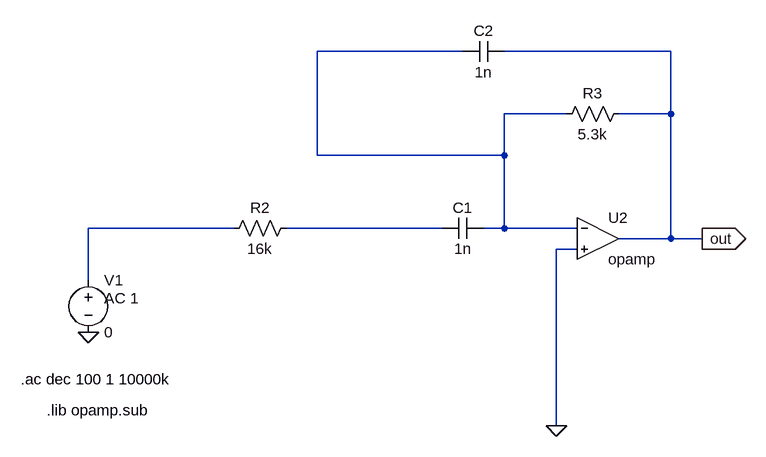
[diagram p0: schematic band_pass_ActFilter1.asc]
band_pass_ActFilter1.asc, the LTspice schematic file:
Version 4
SHEET 1 1200 680
WIRE 352 -512 128 -512
WIRE 672 -512 416 -512
WIRE 512 -416 416 -416
WIRE 672 -416 672 -512
WIRE 672 -416 592 -416
WIRE 128 -352 128 -512
WIRE 416 -352 416 -416
WIRE 416 -352 128 -352
WIRE 0 -240 -224 -240
WIRE 320 -240 80 -240
WIRE 416 -240 416 -352
WIRE 416 -240 384 -240
WIRE 528 -240 416 -240
WIRE 672 -224 672 -416
WIRE 672 -224 592 -224
WIRE 720 -224 672 -224
WIRE 528 -208 496 -208
WIRE -224 -160 -224 -240
WIRE 496 64 496 -208
FLAG 496 64 0
FLAG -224 -80 0
FLAG 720 -224 out
IOPIN 720 -224 Out
SYMBOL res 96 -256 R90
WINDOW 0 0 56 VBottom 2
WINDOW 3 32 56 VTop 2
SYMATTR InstName R2
SYMATTR Value 16k
SYMBOL res 608 -432 R90
WINDOW 0 0 56 VBottom 2
WINDOW 3 32 56 VTop 2
SYMATTR InstName R3
SYMATTR Value 5.3k
SYMBOL cap 384 -256 R90
WINDOW 0 0 32 VBottom 2
WINDOW 3 32 32 VTop 2
SYMATTR InstName C1
SYMATTR Value 1n
SYMBOL cap 416 -528 R90
WINDOW 0 0 32 VBottom 2
WINDOW 3 32 32 VTop 2
SYMATTR InstName C2
SYMATTR Value 1n
SYMBOL voltage -224 -176 R0
WINDOW 123 24 44 Left 2
WINDOW 39 0 0 Left 0
SYMATTR InstName V1
SYMATTR Value 0
SYMATTR Value2 AC 1
SYMBOL OpAmps\\opamp 560 -288 R0
SYMATTR InstName U2
TEXT -328 -8 Left 2 !.ac dec 100 1 10000k
TEXT -288 40 Left 2 !.lib opamp.sub

The netlist it stands for:
* band_pass_ActFilter1.asc
R2 N003 N002 16k
R3 out N001 5.3k
C1 N001 N003 1n
C2 out N001 1n
V1 N002 0 0 AC 1
XU2 N001 0 out opamp Aol=100K GBW=10Meg  ; pins invin noninvin out
.ac dec 100 1 10000k
.lib opamp.sub
.backanno
.end